# Altium schematic sheet Ethernet.SchDoc
size A4; SheetNumber: 2; SheetTotal: 4
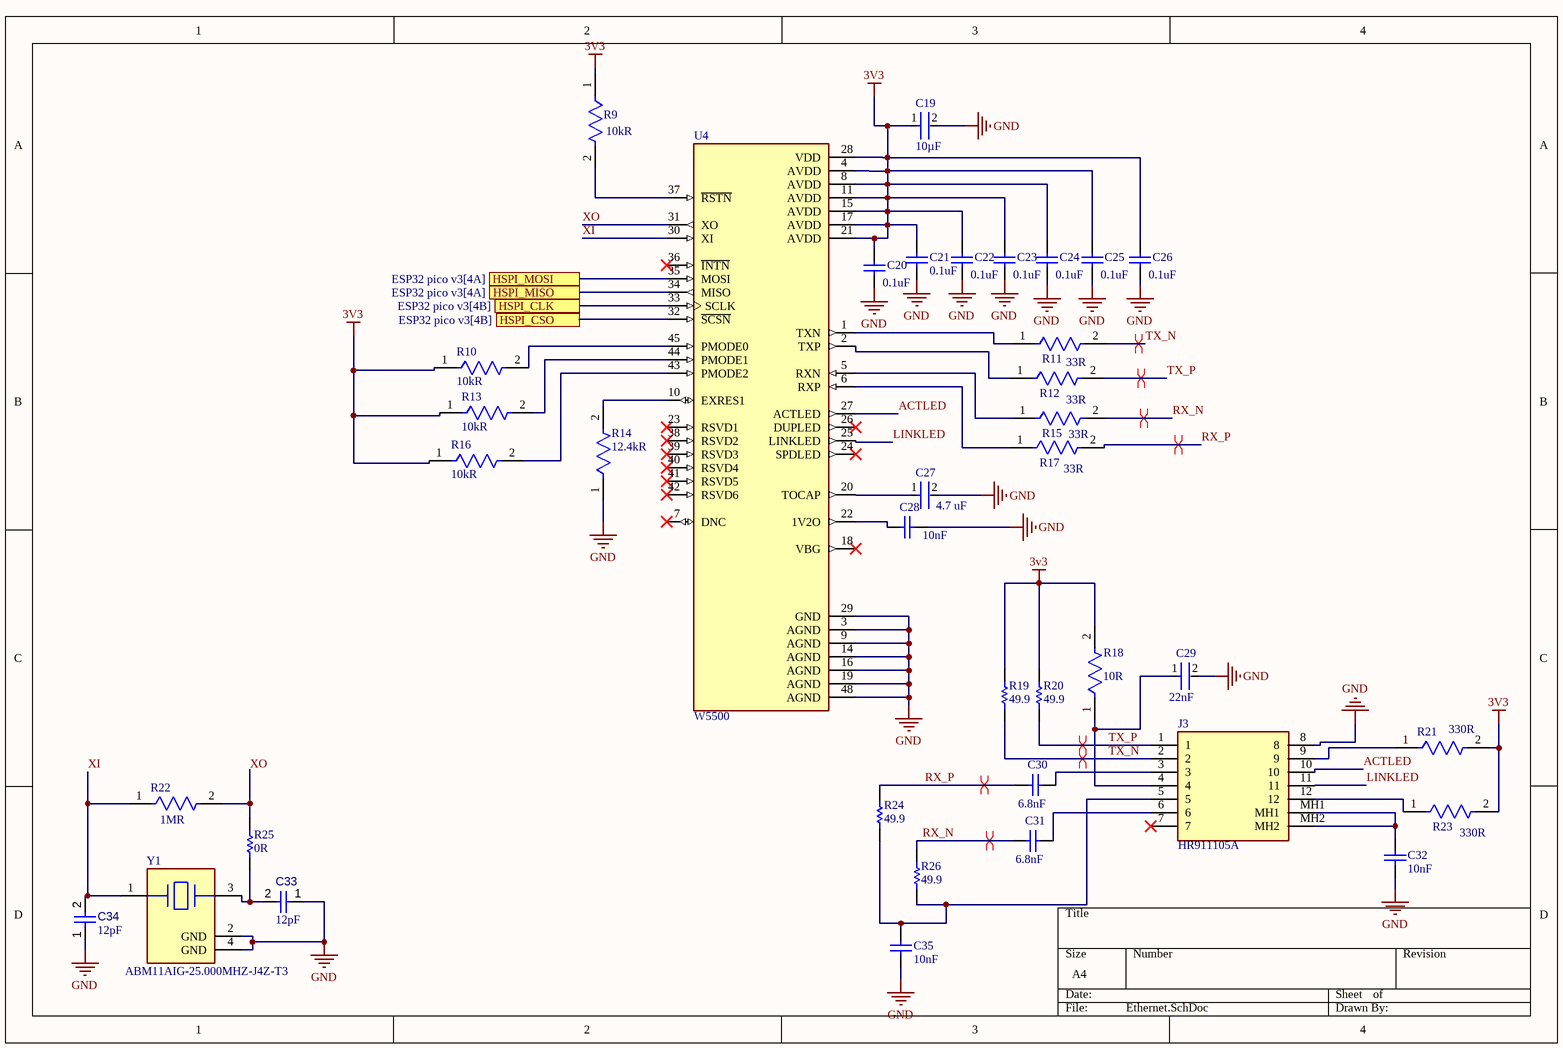
[diagram p0: Ethernet.SchDoc]

## Parts
C19  Capacitance: 10µF  [FP-CC0603-DC-MFG]  (hidden comment: CC0603KRX5R7BB106)
C20  value 0.1uF  [CAPC1005X60X30ML05T10]  (hidden comment: C0402C104M9RACTU)
C21  value 0.1uF  [CAPC1005X60X30ML05T10]  (hidden comment: C0402C104M9RACTU)
C22  value 0.1uF  [CAPC1005X60X30ML05T10]  (hidden comment: C0402C104M9RACTU)
C23  value 0.1uF  [CAPC1005X60X30ML05T10]  (hidden comment: C0402C104M9RACTU)
C24  value 0.1uF  [CAPC1005X60X30ML05T10]  (hidden comment: C0402C104M9RACTU)
C25  value 0.1uF  [CAPC1005X60X30ML05T10]  (hidden comment: C0402C104M9RACTU)
C26  value 0.1uF  [CAPC1005X60X30ML05T10]  (hidden comment: C0402C104M9RACTU)
C27  value 4.7 uF  [FP-CC0603-DA-MFG]  (hidden comment: CC0603KRX5R8BB475)
C28  value 10nF  [CAPC1005X60X26NL10T16]  (hidden comment: VJ0402Y103MXXAC)
C29  value 22nF  [FP-C0402-BB-MFG]  (hidden comment: C0402C223K4RAC7411)
C30  value 6.8nF  [CAPC1005X60X26NL10T16]  (hidden comment: VJ0402Y682KXXAC)
C31  value 6.8nF  [CAPC1005X60X26NL10T16]  (hidden comment: VJ0402Y682KXXAC)
C32  value 10nF  [CAPC1005X60X26NL10T16]  (hidden comment: VJ0402Y103MXXAC)
C33  value 12pF  [CAPC0402(1005)33_L]  (hidden comment: Capacitor 12pF +/-10% 50V 0402)
C34  value 12pF  [CAPC0402(1005)33_L]  (hidden comment: Capacitor 12pF +/-10% 50V 0402)
C35  value 10nF  [CAPC1005X60X26NL10T16]  (hidden comment: VJ0402Y103MXXAC)
J3  HR911105A  [HR911105A]
R9  value 10kR  [FP-AC0603-IPC_B]  (hidden comment: AC0603FR-7W10KL)
R10  value 10kR  [FP-AC0603-IPC_B]  (hidden comment: AC0603FR-7W10KL)
R11  Resistance: 33R  [FP-AC0603-IPC_C]  (hidden comment: AC0603JR-07330RL)
R12  Resistance: 33R  [FP-AC0603-IPC_C]  (hidden comment: AC0603JR-07330RL)
R13  value 10kR  [FP-AC0603-IPC_B]  (hidden comment: AC0603FR-7W10KL)
R14  Resistance: 12.4kR  [FP-RK73H1E-IPC_C]  (hidden comment: RK73H1ERTTP1242F)
R15  Resistance: 33R  [FP-AC0603-IPC_C]  (hidden comment: AC0603JR-07330RL)
R16  value 10kR  [FP-AC0603-IPC_B]  (hidden comment: AC0603FR-7W10KL)
R17  Resistance: 33R  [FP-AC0603-IPC_C]  (hidden comment: AC0603JR-07330RL)
R18  Resistance: 10R  [FP-RMCF0402-IPC_B]  (hidden comment: RMCF0402FT10R0)
R19  value 49.9  [RESC1005X40X25ML05T10]  (hidden comment: RC0402FR-1349R9L)
R20  value 49.9  [RESC1005X40X25ML05T10]  (hidden comment: RC0402FR-1349R9L)
R21  Resistance: 330R  [FP-AC0603-IPC_C]  (hidden comment: AC0603JR-07330RL)
R22  Resistance: 1MR  [FP-CRGCQ0402-IPC_C]  (hidden comment: CRGCQ0402F1M0)
R23  Resistance: 330R  [FP-AC0603-IPC_C]  (hidden comment: AC0603JR-07330RL)
R24  value 49.9  [RESC1005X40X25ML05T10]  (hidden comment: RC0402FR-1349R9L)
R25  value 0R  [RESC1005X40X25NL05T10]  (hidden comment: RC0402JR-100RL)
R26  value 49.9  [RESC1005X40X25ML05T10]  (hidden comment: RC0402FR-1349R9L)
U4  W5500  [QFP50P900X900X160-48N]
Y1  ABM11AIG-25.000MHZ-J4Z-T3  [FP-ABM11AIG-MFG]

## Ports
HSPI_CLK (see ESP32 pico v3[4B]), HSPI_CSO (see ESP32 pico v3[4B]), HSPI_MISO (see ESP32 pico v3[4A]), HSPI_MOSI (see ESP32 pico v3[4A])

## Nets
3V3: C19.1 C20.2 C21.2 C22.2 C23.2 C24.2 C25.2 C26.2 R9.1 R10.1 R13.1 R16.1 R18.2 R19.2 R20.2 R21.2 R23.2 U4.4(AVDD) U4.8(AVDD) U4.11(AVDD) U4.15(AVDD) U4.17(AVDD) U4.21(AVDD) U4.28(VDD)
GND: C19.2 C20.1 C21.1 C22.1 C23.1 C24.1 C25.1 C26.1 C27.2 C28.2 C29.2 C32.1 C33.1 C34.1 C35.1 J3.8 R14.1 U4.3(AGND) U4.9(AGND) U4.14(AGND) U4.16(AGND) U4.19(AGND) U4.29(GND) U4.48(AGND) Y1.2(GND) Y1.4(GND)
ACTLED: J3.10 U4.27(ACTLED)
HSPI_CLK: U4.33(SCLK) ; port HSPI_CLK
HSPI_CSO: U4.32(~{SCSN}) ; port HSPI_CSO
HSPI_MISO: U4.34(MISO) ; port HSPI_MISO
HSPI_MOSI: U4.35(MOSI) ; port HSPI_MOSI
LINKLED: J3.11 U4.25(LINKLED)
RX_N: C31.1 R15.2 R26.2
RX_P: C30.1 R17.2 R24.2
TX_N: J3.2 R11.2 R19.1
TX_P: J3.1 R12.2 R20.1
XI: C34.2 R22.1 U4.30(XI) Y1.1(1_Crystal)
XO: R22.2 R25.2 U4.31(XO)
NetC27_1: C27.1 U4.20(TOCAP)
NetC28_1: C28.1 U4.22(1V2O)
NetC29_1: C29.1 J3.4 R18.1
NetC30_2: C30.2 J3.3
NetC31_2: C31.2 J3.6
NetC32_2: C32.2 J3.MH1 J3.MH2
NetC33_2: C33.2 R25.1 Y1.3(2_Crystal)
NetC35_2: C35.2 J3.5 R24.1 R26.1
NetJ3_9: J3.9 R21.1
NetJ3_12: J3.12 R23.1
NetR9_2: R9.2 U4.37(~{RSTN})
NetR10_2: R10.2 U4.45(PMODE0)
NetR11_1: R11.1 U4.1(TXN)
NetR12_1: R12.1 U4.2(TXP)
NetR13_2: R13.2 U4.44(PMODE1)
NetR14_2: R14.2 U4.10(EXRES1)
NetR15_1: R15.1 U4.5(RXN)
NetR16_2: R16.2 U4.43(PMODE2)
NetR17_1: R17.1 U4.6(RXP)

Not connected (* = marked no-connect by the designer): J3 7*; U4 7(DNC)* 18(VBG)* 23(RSVD1)* 24(SPDLED)* 26(DUPLED)* 36(~{INTN})* 38(RSVD2)* 39(RSVD3)* 40(RSVD4)* 41(RSVD5)* 42(RSVD6)*

## Layout directives
differential pair: RX_N, RX_P, TX_N, TX_P

## Library data of the parts
C19 = CMP-00621-81932632-1: CC0603KRX5R7BB106 Multilayer Ceramic Capacitor, 10 uF, 16 V, ± 10%, X5R, 0603 [1608 Metric]; Voltage Rating: 16V; NexarPartId: 81932632; Height: 1mm; Halogen Free: Halogen Free; Dielectric: X5R; Max Operating Temperature: 85°C; Voltage Rating (DC): 16V; Material: Ceramic; Lead Free: Lead Free; Tolerance: 10%; RoHS: Non-Compliant; Min Operating Temperature: -55°C; Case/Package: 0603
C20-C26 = CMP-2008-02199-1: Manufacturer: Kemet; Part Number: C0402C104M9RACTU
C27 = CMP-03422-001217-1: CAP CER 4.7UF 25V X5R 0603; Manufacturer: YAGEO; Material: Ceramic; Temperature Coefficient: 15%; Tolerance: 0.1; Device Class L1: Passive Components; Temperature: -55°C to +125°C; RoHS: TRUE; Temperature Range High: +125°C; Automotive: No; Lead Free: Yes; Digikey Description: CAP CER 4.7UF 25V X5R 0603; Category: Cap; Temperature Characteristic: X5R; Manufacturer Part Number: CC0603KRX5R8BB475; Package: CC0603-DA; Device Class L2: Capacitors; Temperature Range Low: -55°C; Voltage Rating: 25 V; Capacitance: 4.7 uF; ComponentLink2URL: http://www.yageo.com/documents/recent/UPY-GPHC_X7R_6.3V-to-50V_18.pdf; Octopart: https://octopart.com/cc0603krx5r8bb475-yageo-77825350; Footprint Url: http://www.yageo.com/exep/pages/download/literatures/UPY-C_GEN_24.pdf; Device Class L3: Ceramic Capacitors; ComponentLink2Description: Datasheet; Voltage: 25 V; Height: 0.9mm
C28 C32 C35 = CMP-2008-01205-1: Manufacturer: Vitramon; Part Number: VJ0402Y103MXXAC
C29 = CMP-03020-007459-1: C0402 22,000 pF X7R 10.00% 16 V; Manufacturer: Kemet; Voltage Rating: 16 V; Temperature Coefficient: 15%; Material: Ceramic; Tolerance: 0.1; Temperature Range High: +125°C; Category: Cap; Manufacturer Part Number: C0402C223K4RAC7411; Device Class L1: Passive Components; Temperature Characteristic: X7R; Package: C0402-BB; Capacitance: 22,000 pF; Device Class L2: Capacitors; Temperature Range Low: -55°C; ComponentLink2Description: Datasheet; Lead Free: Yes; Automotive: No; RoHS: TRUE; Device Class L3: Ceramic Capacitors; Octopart: https://octopart.com/c0402c223k4rac7411-kemet-89441538; Ipc Land Pattern Name: CAPC10050X50; ComponentLink2URL: https://content.kemet.com/datasheets/KEM_C1002_X7R_SMD.pdf; Height: 0.55mm; Temperature: -55°C to +125°C
C30 C31 = CMP-1034-01847-2: Manufacturer: Vitramon; Part Number: VJ0402Y682KXXAC
C33 C34 = CMP-001-00072-4: Chip Capacitor, 12pF +/-10%, 50V, 0402, Thickness 0.33 mm; Tolerance: 20%; Pins: 2; Max Operating Temperature: 85°C; Case/Package: 0402; Voltage Rating: 50V; Mounting Technology: SMT; Min Operating Temperature: -55°C
J3 = HR911105A: Connector; Manufacturer_Name: Hanrun Electronics; Datasheet Link: https://datasheet.lcsc.com/szlcsc/Zhongshan-HanRun-Elec-HR911105A_C12074.pdf; Height: 13.75mm; Manufacturer_Part_Number: HR911105A
R9 R10 R13 R16 = CMP-03412-038553-1: RES 10kΩ 1.00% 0.2W 0603
R11 R12 R15 R17 R21 R23 = CMP-03412-039929-1: RES 330Ω 5.00% 0.1W 0603; Voltage Rating: 50V; Power Rating: 100mW; Tolerance: 5%; Temperature Coefficient: 100ppm/°C; Series: AC; Case/Package: 0603; Weight: 7.1E-05oz; Min Operating Temperature: -55°C; Ratings: AEC-Q200; Width: 0.8mm; Resistor Type: Thick Film; Termination: SMD/SMT; Number of Terminations: 2; Max Power Dissipation: 100mW; Case Code (Imperial): 0603; Case Code (Metric): 1608; Height: 0.45mm; Max Operating Temperature: 155°C; Length: 1.6mm; RoHS Compliant: Yes; Features: Moisture Resistant; Packaging: Tape and Reel
R14 = CMP-04015-098464-1: 12.4kΩ ±1% 0.1W Chip Resistor 0402 Flat Chip (Anti-Sulfuration) AEC-Q200 Qualified; Voltage Rating: 50V; Temperature Coefficient: 100ppm/°C; Power Rating: 63mW; Case/Package: 0402; Case Code (Imperial): 0402; Height: 0.35mm; Packaging: Tape and Reel; Width: 0.5mm; Weight: 2.3E-05oz; Max Operating Temperature: 155°C; RoHS Compliant: Yes; Package Quantity: 10000; Tolerance: 1%; Case Code (Metric): 1005; Termination: SMD/SMT; Length: 1mm; Min Operating Temperature: -55°C
R18 = CMP-26527-003397-1: 10Ω ±1% 0.063W 0402 Thick Film Chip Resistor AEC-Q200 compliant; Power Rating: 63mW; Temperature Coefficient: 100ppm/°C; RoHS Compliant: Yes; Max Operating Temperature: 155°C; Case Code (Metric): 1005; Lead Free: Lead Free; Contact Plating: Tin; Height: 0.016inch; Length: 0.039inch; Features: Automotive AEC-Q200; Resistor Type: Thick Film; Depth: 0.5mm; Min Operating Temperature: -55°C; Case Code (Imperial): 0402; Max Power Dissipation: 63mW; Radiation Hardening: No; Mount: Surface Mount; Packaging: Tape and Reel; Military Standard: Not; Number of Terminations: 2; Case/Package: 0402; Tolerance: 1%; Width: 0.02inch; Size Code: 0402; Construction: Rectangular; Series: RMCF
R19 R20 R24 R26 = CMP-2002-07892-1: Manufacturer: Yageo; Part Number: RC0402FR-1349R9L
R22 = CMP-03211-005885-1: Res Thick Film 0402 1M Ohm 1% 0.063W(1/16W) ±100ppm/C Pad SMD Automotive T/R; Manufacturer: TE Connectivity; Power Rating: 0.0625W; Tolerance: 0.01; Voltage Rating: 50V; Value: 1MΩ; Temperature Coefficient: ±100ppm/°C; Series: CRGCQ; Digikey Description: Res Thick Film 0402 1M Ohm 1% 0.063W(1/16W) ±100ppm/C Pad SMD Automotive T/R; Automotive: Yes; ComponentLink2URL: https://www.te.com/commerce/DocumentDelivery/DDEController?Action=showdoc&DocId=Data+Sheet%7F1773204-3%7F1%7Fpdf%7FEnglish%7FENG_DS_1773204-3_1.pdf%7F4-2176347-1378; Ipc Land Pattern Name: RESC10050X35; Manufacturer Part Number: CRGCQ0402F1M0; Category: Res; ComponentLink2Description: Datasheet; Temperature Range High: +155°C; Temperature Range Low: -55°C; Device Class L3: Chip SMD Resistors; RoHS: TRUE; Lead Free: Yes; Octopart: https://octopart.com/crgcq0402f1m0-te+connectivity-91017950; Ambient Temperature Range High: +70°C; Package: CRGCQ0402; Mouser Description: Res Thick Film 0402 1M Ohm 1% 0.063W(1/16W) ±100ppm/C Pad SMD Automotive T/R; Device Class L1: Passive Components; Temperature: -55°C to +155°C; Composition: Thick Film; Device Class L2: Resistors; Height: 0.4mm
R25 = CMP-2002-06970-1: Manufacturer: Yageo; Part Number: RC0402JR-100RL
U4 = W5500: Hardwired TCP/IP embedded Ethernet controller; Package: None; Price: None; MP: W5500; Availability: Unavailable; Value: *
Y1 = CMP-27762-012485-1: Crystal 25MHz ±30ppm 10pF SMD-4 2.5mm x 2mm Automotive; ESR (Equivalent Series Resistance): 100R; Frequency Stability: 50ppm; Case/Package: SMD/SMT; RoHS Compliant: Yes; Width: 0.079inch; Ratings: AEC-Q200; Height: 0.024inch; Max Operating Temperature: 105°C; Frequency Tolerance: 30ppm; Packaging: Tape and Reel; Mount: Surface Mount; Length: 0.098inch; Load Capacitance: 10pF; Min Operating Temperature: -40°C; Frequency: 25MHz